# Altium schematic sheet L9110.SchDoc
size A4
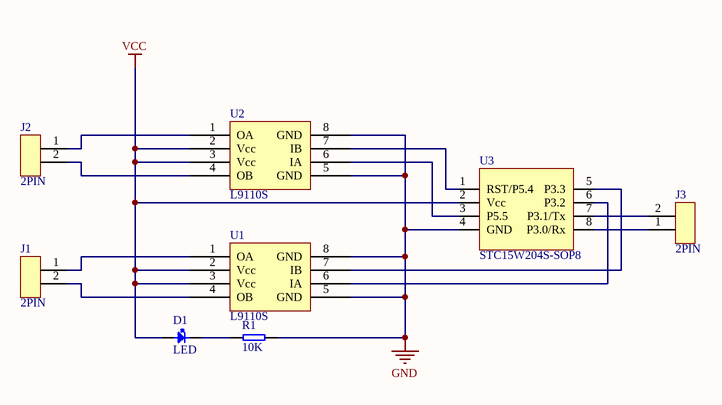
[diagram p0: L9110.SchDoc]

## Parts
D1  LED  [LED0805]
J1  2PIN  [2PIN]
J2  2PIN  [2PIN]
J3  2PIN  [2PIN]
R1  10K  [RES0603]
U1  L9110S  [SOP8]
U2  L9110S  [SOP8]
U3  STC15W204S-SOP8

## Nets
GND: R1.2 U1.5(GND) U1.8(GND) U2.5(GND) U2.8(GND) U3.4(GND)
VCC: D1.1(A) U1.2(Vcc) U1.3(Vcc) U2.2(Vcc) U2.3(Vcc) U3.2(Vcc)
NetD1_2: D1.2(K) R1.1
NetJ1_1: J1.1 U1.1(OA)
NetJ1_2: J1.2 U1.4(OB)
NetJ2_1: J2.1 U2.1(OA)
NetJ2_2: J2.2 U2.4(OB)
NetJ3_1: J3.1 U3.8(P3.0/Rx)
NetJ3_2: J3.2 U3.7(P3.1/Tx)
NetU1_6: U1.6(IA) U3.6(P3.2)
NetU1_7: U1.7(IB) U3.5(P3.3)
NetU2_6: U2.6(IA) U3.3(P5.5)
NetU2_7: U2.7(IB) U3.1(RST/P5.4)

## Library data of the parts
R1 = RES